# Altium schematic sheet Схема GSM Velvet Controller.SchDoc
size A3; SheetNumber: 5; SheetTotal: 6
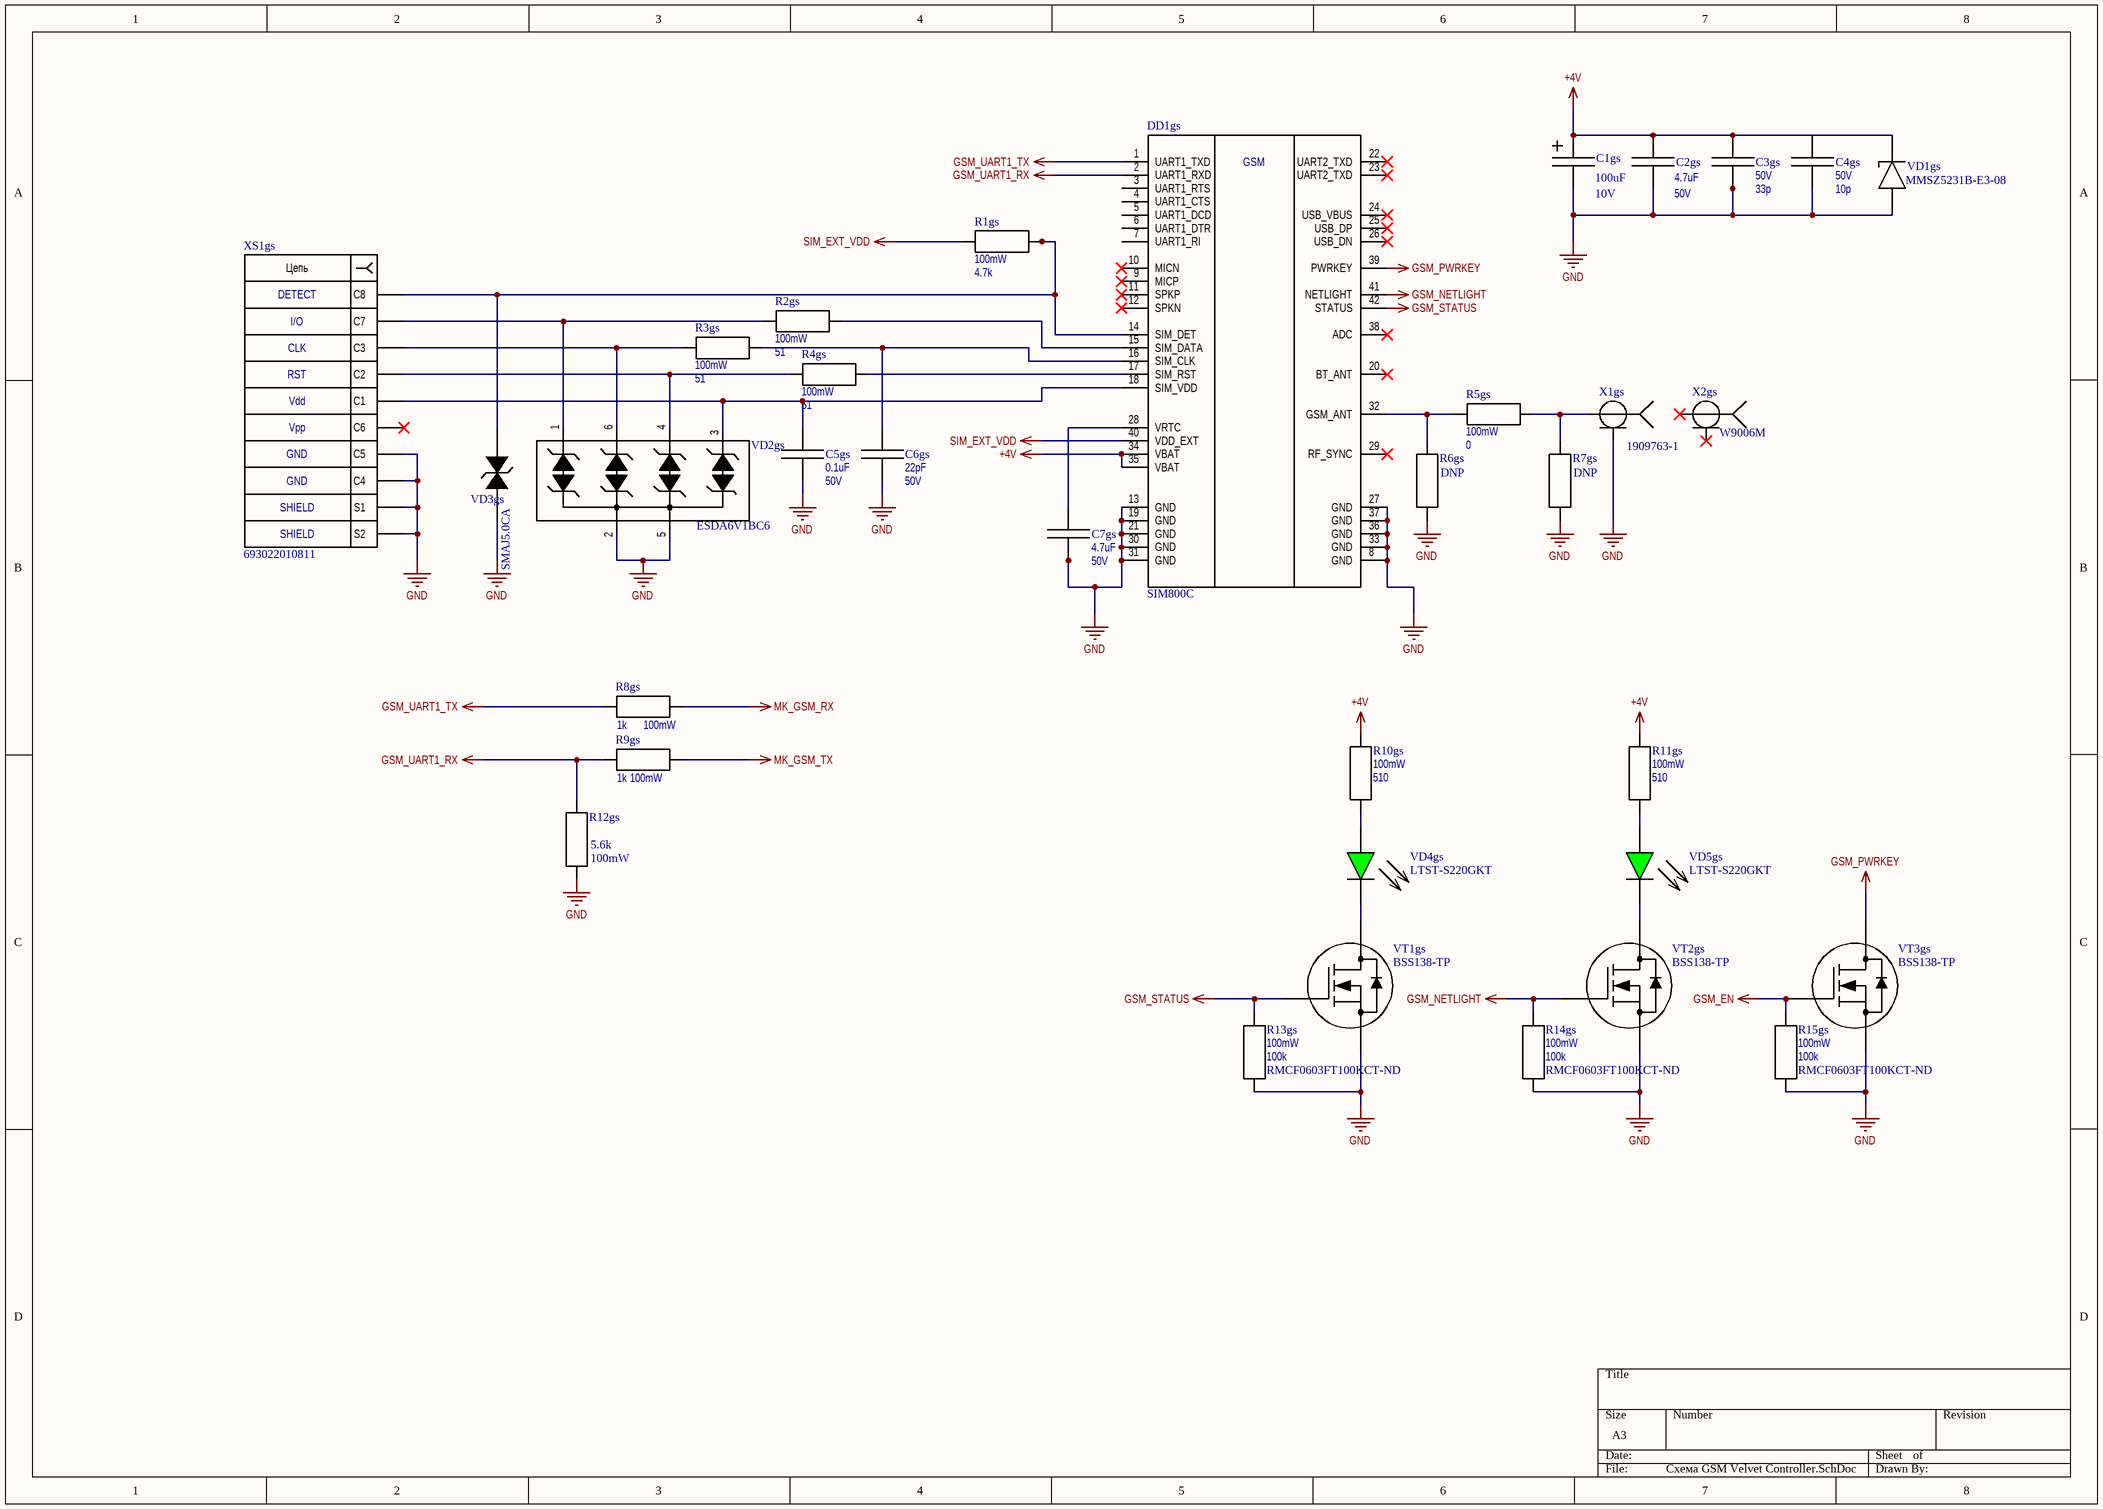
[diagram p0: Схема GSM Velvet Controller.SchDoc]

## Parts
C1gs  Capacitance: 100uF  Rated Voltage: 10V  [CAP 2917 (D)]  (hidden comment: TPSD107M010R0050)
C2gs  Capacitance: 4.7uF  Rated Voltage: 50V  [CAP 0805 IPC MAX]  (hidden comment: CL21A475KBQNNNE)
C3gs  Rated Voltage: 50V  Capacitance: 33p  [CAP 0603 IPC MAX]  (hidden comment: C0603C330J5GAC7867)
C4gs  Rated Voltage: 50V  Capacitance: 10p  [CAP 0603 IPC MAX]  (hidden comment: CC0603JRNPO9BN100)
C5gs  Capacitance: 0.1uF  Rated Voltage: 50V  [CAP 0603 IPC MAX]  (hidden comment: GCM188R71H104KA57D)
C6gs  Capacitance: 22pF  Rated Voltage: 50V  [CAP 0603 IPC MAX]  (hidden comment: CC0603JRNPO9BN220)
C7gs  Capacitance: 4.7uF  Rated Voltage: 50V  [CAP 0805 IPC MAX]  (hidden comment: CL21A475KBQNNNE)
DD1gs  SIM800C  [SIM-800C]
R1gs  Rated Power: 100mW  Resistance: 4.7k  [RES 0603 IPC MAX]  (hidden comment: RMCF0603FT4K70)
R2gs  Rated Power: 100mW  Resistance: 51  [RES 0603 IPC MAX]  (hidden comment: RMCF0603FT51R0)
R3gs  Rated Power: 100mW  Resistance: 51  [RES 0603 IPC MAX]  (hidden comment: RMCF0603FT51R0)
R4gs  Rated Power: 100mW  Resistance: 51  [RES 0603 IPC MAX]  (hidden comment: RMCF0603FT51R0)
R5gs  Rated Power: 100mW  Resistance: 0  [RES 0603 IPC MAX]  (hidden comment: RMCF0603ZT0R00)
R6gs  DNP  [RES 0603 IPC MAX]
R7gs  DNP  [RES 0603 IPC MAX]
R8gs  Resistance: 1k  Rated Power: 100mW  [RES 0603 IPC MAX]  (hidden comment: RMCF0603FT1K00)
R9gs  Resistance: 1k  Rated Power: 100mW  [RES 0603 IPC MAX]  (hidden comment: RMCF0603FT1K00)
R10gs  Power Rated: 100mW  Resistance: 510  [RES 0603 IPC MAX]  (hidden comment: RMCF0603JT510R)
R11gs  Power Rated: 100mW  Resistance: 510  [RES 0603 IPC MAX]  (hidden comment: RMCF0603JT510R)
R12gs  Resistance: 5.6k  Rated Power: 100mW  [RES 0603 IPC MAX]  (hidden comment: RMCF0603FT5K60)
R13gs  Power Rated: 100mW  Resistance: 100k  Supplier Part Number 1: RMCF0603FT100KCT-ND  [RES 0603 IPC MAX]  (hidden comment: RMCF0603FT100K)
R14gs  Power Rated: 100mW  Resistance: 100k  Supplier Part Number 1: RMCF0603FT100KCT-ND  [RES 0603 IPC MAX]  (hidden comment: RMCF0603FT100K)
R15gs  Power Rated: 100mW  Resistance: 100k  Supplier Part Number 1: RMCF0603FT100KCT-ND  [RES 0603 IPC MAX]  (hidden comment: RMCF0603FT100K)
VD1gs  MMSZ5231B-E3-08  [SOD-123 (Marked)]
VD2gs  ESDA6V1BC6  [SOT-23-6]
VD3gs  SMAJ5.0CA  [DO-214AC Bidirectional]
VD4gs  LTST-S220GKT  [0805 DIODE]
VD5gs  LTST-S220GKT  [0805 DIODE]
VT1gs  BSS138-TP  [SOT-23-3]
VT2gs  BSS138-TP  [SOT-23-3]
VT3gs  BSS138-TP  [SOT-23-3]
X1gs  1909763-1  [1909763-1]
X2gs  W9006M  (mechanical)
XS1gs  693022010811  [693022010811]

## Nets
+4V: C1gs.1 C2gs.1 C3gs.1 C4gs.1 DD1gs.34(VBAT) DD1gs.35(VBAT) R10gs.2 R11gs.2 VD1gs.1
GND: C1gs.2 C2gs.2 C3gs.2 C4gs.2 C5gs.2 C6gs.2 C7gs.2 DD1gs.8(GND) DD1gs.13(GND) DD1gs.19(GND) DD1gs.21(GND) DD1gs.27(GND) DD1gs.30(GND) DD1gs.31(GND) DD1gs.33(GND) DD1gs.36(GND) DD1gs.37(GND) R6gs.1 R7gs.1 R12gs.1 R13gs.1 R14gs.1 R15gs.1 VD1gs.2 VD2gs.2 VD2gs.5 VD3gs.1 VT1gs.2(S) VT2gs.2(S) VT3gs.2(S) X1gs.2 XS1gs.C4 XS1gs.C5 XS1gs.S1 XS1gs.S2
GSM_EN: R15gs.2 VT3gs.1(G)
GSM_NETLIGHT: DD1gs.41(NETLIGHT) R14gs.2 VT2gs.1(G)
GSM_PWRKEY: DD1gs.39(PWRKEY) VT3gs.3(D)
GSM_STATUS: DD1gs.42(STATUS) R13gs.2 VT1gs.1(G)
GSM_UART1_RX: DD1gs.2(UART1_RXD) R9gs.1 R12gs.2
GSM_UART1_TX: DD1gs.1(UART1_TXD) R8gs.1
MK_GSM_RX: R8gs.2
MK_GSM_TX: R9gs.2
SIM_EXT_VDD: DD1gs.40(VDD_EXT) R1gs.1
NetC5gs_1: C5gs.1 DD1gs.18(SIM_VDD) VD2gs.3 XS1gs.C1
NetC6gs_1: C6gs.1 DD1gs.16(SIM_CLK) R3gs.2
NetC7gs_1: C7gs.1 DD1gs.28(VRTC)
NetDD1gs_14: DD1gs.14(SIM_DET) R1gs.2 VD3gs.2 XS1gs.C8
NetDD1gs_15: DD1gs.15(SIM_DATA) R2gs.2
NetDD1gs_17: DD1gs.17(SIM_RST) R4gs.2
NetDD1gs_32: DD1gs.32(GSM_ANT) R5gs.1 R6gs.2
NetR2gs_1: R2gs.1 VD2gs.1 XS1gs.C7
NetR3gs_1: R3gs.1 VD2gs.6 XS1gs.C3
NetR4gs_1: R4gs.1 VD2gs.4 XS1gs.C2
NetR5gs_2: R5gs.2 R7gs.2 X1gs.1
NetR10gs_1: R10gs.1 VD4gs.1
NetR11gs_1: R11gs.1 VD5gs.1
NetVD4gs_2: VD4gs.2 VT1gs.3(D)
NetVD5gs_2: VD5gs.2 VT2gs.3(D)

Not connected (* = marked no-connect by the designer): DD1gs 3(UART1_RTS) 4(UART1_CTS) 5(UART1_DCD) 6(UART1_DTR) 7(UART1_RI) 9(MICP)* 10(MICN)* 11(SPKP)* 12(SPKN)* 20(BT_ANT)* 22(UART2_TXD)* 23(UART2_TXD)* 24(USB_VBUS)* 25(USB_DP)* 26(USB_DN)* 29(RF_SYNC)* 38(ADC)*; X2gs 1* 2*; XS1gs C6*

## Notes on the sheet
- (in symbol 693022010811) Цепь; DETECT; I/O; CLK; RST; Vdd; Vpp; GND; SHIELD
- (in symbol SIM800C) GSM

## Library data of the parts
C1gs = TPSD107M010R0050: CAP SMD TANT 100UF 20% 10V 2917; Manufacturer 1: KYOCERA AVX; Type: Molded; ESR: 50mOhm; Manufacturer Part Number 1: TPSD107M010R0050; Min Operating Temperature: -55°C; Max Operating Temperature: 125°C; Tolerance: 20%; Size Code: 2917; Mounting: SM; Package: D
C2gs C7gs = CL21A475KBQNNNE: CAP SMD CER 4.7UF 50V X5R 0805; Manufacturer 1: Samsung Electro-Mechanics; Tolerance: 10%; Type: Multilayer Ceramic; Manufacturer Part Number 1: CL21A475KBQNNNE; Min Operating Temperature: -55°C; Max Operating Temperature: 85°C; Mounting: SM; Package: 0805; Supplier 1: Digi-Key; Supplier Part Number 1: 1276-1248-1-ND
C3gs = C0603C330J5GAC7867: CAP SMD CER 33PF 50V C0G/NP0 0603; Manufacturer 1: KEMET; Tolerance: 5%; Type: Multilayer Ceramic; Manufacturer Part Number 1: C0603C330J5GAC7867; Min Operating Temperature: -55°C; Max Operating Temperature: 125°C; Mounting: SM; Package: 0603; Supplier 1: Digi-Key
C4gs = CC0603JRNPO9BN100: CAP SMD CER 10PF 50V C0G/NP0 0603; Manufacturer 1: YAGEO; Tolerance: 5%; Type: Multilayer Ceramic; Manufacturer Part Number 1: CC0603JRNPO9BN100; Min Operating Temperature: -55°C; Max Operating Temperature: 125°C; Mounting: SM; Package: 0603; Supplier 1: Digi-Key; Supplier Part Number 1: 311-1058-1-ND
C5gs = GCM188R71H104KA57D: CAP SMD CER 0.1UF 50V X7R 0603; Manufacturer 1: Murata Electronics; Tolerance: 10%; Type: Multilayer Ceramic; Manufacturer Part Number 1: GCM188R71H104KA57D; Min Operating Temperature: -55°C; Max Operating Temperature: 125°C; Mounting: SM; Package: 0603; Supplier 1: Digi-Key; Supplier Part Number 1: 490-4779-1-ND
C6gs = CC0603JRNPO9BN220: CAP SMD CER 22PF 50V NP0  0603; Manufacturer 1: YAGEO; Tolerance: 5%; Type: Multilayer Ceramic; Manufacturer Part Number 1: CC0603JRNPO9BN220; Min Operating Temperature: -55°C; Max Operating Temperature: 125°C; Mounting: SM; Package: 0603; Supplier 1: Digi-Key; Supplier Part Number 1: 311-1062-1-ND
DD1gs = SIM800C: GSM/GPRS Module; Manufacturer 1: SIMCom; Supply Voltage: 4V; Manufacturer Part Number 1: SIM800C; Max Operating Temperature: +85 °C; Min Operating Temperature: -40 °C; Parameter 6: *; Parameter 7: *; Parameter 8: *; Parameter 9: *; Parameter 10: *; Parameter 11: *; Parameter 12: *; Parameter 13: *; Parameter 14: *; Parameter 15: *
R1gs = RMCF0603FT4K70: RES SMD 4.7k OHM 1% 1/10W 0603; Manufacturer 1: Stackpole Electronics Inc; Rated Voltage: 75V; Qualification: AEC-Q200; Manufacturer Part Number 1: RMCF0603FT4K70; Tolerance: 1%; Package: 0603; Min Operating Temperature: -55°C; Max Operating Temperature: 155°C
R2gs R3gs R4gs = RMCF0603FT51R0: RES SMD 51 OHM 1% 1/10W 0603; Manufacturer 1: Stackpole Electronics Inc; Rated Voltage: 75V; Qualification: AEC-Q200; Manufacturer Part Number 1: RMCF0603FT51R0; Tolerance: 1%; Package: 0603; Min Operating Temperature: -55°C; Max Operating Temperature: 155°C
R5gs = RMCF0603ZT0R00: RES SMD 0 OHM 1% 1/10W 0603; Manufacturer 1: Stackpole Electronics Inc; Rated Voltage: 75V; Qualification: AEC-Q200; Manufacturer Part Number 1: RMCF0603ZT0R00; Tolerance: 1%; Package: 0603; Min Operating Temperature: -55°C; Max Operating Temperature: 155°C
R6gs R7gs = RES GOST: RES SMD/TH ?R (&K) OHM ?% ?W (PACKAGE)
R8gs R9gs = RMCF0603FT1K00: RES SMD 1K OHM 1% 1/10W 0603; Manufacturer 1: Stackpole Electronics Inc; Rated Voltage: 75V; Qualification: AEC-Q200; Manufacturer Part Number 1: RMCF0603FT1K00; Tolerance: 1%; Package: 0603; Min Operating Temperature: -55°C; Max Operating Temperature: 155°C
R10gs R11gs = RMCF0603JT510R: RES SMD 510 OHM 5% 1/10W 0603; Manufacturer 1: Stackpole Electronics Inc; Voltage Rated: 75V; Manufacturer Part Number 1: RMCF0603JT510R; Min Operating Temperature: -55°C; Max Operating Temperature: 155°C; Tolerance: 5%; Package: 0603; Ratings: AEC-Q200; Supplier 1: Digi-Key; Supplier Part Number 1: RMCF0603JT510RCT-ND
R12gs = RMCF0603FT5K60: RES SMD 5.6K OHM 1% 1/10W 0603; Manufacturer Part Number 1: RMCF0603FT1K00; Manufacturer 1: Stackpole Electronics Inc; Rated Voltage: 75V; Qualification: AEC-Q200; Tolerance: 1%; Package: 0603; Min Operating Temperature: -55°C; Max Operating Temperature: 155°C
R13gs R14gs R15gs = RMCF0603FT100K: RES SMD 100K OHM 5% 1/10W 0603; Manufacturer 1: Stackpole Electronics Inc; Voltage Rated: 75V; Manufacturer Part Number 1: RMCF0603FT100K; Min Operating Temperature: -55°C; Max Operating Temperature: 155°C; Tolerance: 5%; Package: 0603; Ratings: AEC-Q200; Supplier 1: Digi-Key
VD1gs = MMSZ5231B-E3-08: DIODE ZENER 5.1V 500MW SOD123; Manufacturer 1: Vishay General Semiconductor - Diodes Division; Tolerance: 5%; Max Impedance: 17 Ohm; Reverse Current: 5uA; Manufacturer Part Number 1: MMSZ5231B-E3-08; Min Operating Temperature: -55°C; Max Operating Temperature: 150°C; Zener Voltage: 5.1V; Max Power: 500mW; Package: SOD-123; Mounting: SM
VD2gs = ESDA6V1BC6: TVS DIODE 5VWM SOT23-6; Manufacturer 1: STMicroelectronics; Voltage - Reverse Standoff (Typ): 5V; Voltage - Breakdown (Min): 6.1V; Type: Biderectional; Number Of Chanels: 4; Max Pulse Power: 80W; Manufacturer Part Number 1: ESDA6V1BC6; Mounting: SM; Max Operating Temperature: 125°C; Min Operating Temperature: -40°C; Package: SOT-23-6
VD3gs = SMAJ5.0CA: TVS DIODE 5VWM 9.2VC DO214AC; Manufacturer 1: Littelfuse Inc.; Voltage - Reverse Standoff (Typ): 5V; Voltage - Breakdown (Min): 6.4V; Voltage - Clamping (Max) @ Ipp: 9.2V; Current - Peak Pulse (10/1000µs): 28A (8/20µs); Type: Biderectional; Number Of Chanels: 6; Max Pulse Power: 350W; Manufacturer Part Number 1: SMAJ5.0CA; Mounting: 43.5A; Max Operating Temperature: 150°C; Min Operating Temperature: -65°C; Package: SMA
VD4gs VD5gs = LTST-S220GKT: LED GREEN CLEAR SMD R/A; Manufacturer 1: Lite-On Inc.; Max Continious Current: 30mA; Max Pulse Current: 120mA; Reverse Voltage: 5V; Power Dissipation: 100mW; Forward Voltage: 2.2V; Manufacturer Part Number 1: LTST-S220GKT; Max Operating Temperature: +85°C; Package: 0805
VT1gs VT2gs VT3gs = BSS138-TP: MOSFET N-CH 50V 220MA SOT23; Manufacturer 1: Micro Commercial Co; Type: P-Chanel; Rds On (Max): 3.5Ohm; Vth: 1.5V; Gate Charge: 1.65nC; Vgs Max: 20V; Input Capacitance: 60pF; Max Power Dissipation: 350mW; Vds Max: 50V; Max Drain Current: 220mA; Min Operating Temperature: -55°C; Max Operating Temperature: 150°C; Mounting Type: SM; Package: SOT-23; Manufacturer Part Number 1: BSS138-TP; Supplier 1: Digi-Key; Supplier Part Number 1: BSS138-TPMSCT-ND
X1gs = 1909763-1: CONN UMCC JACK STR 50OHM SMD; pin to pad: 2>2+3
X2gs = W9006M: CABLE ASSY 6" SMA FM TO I-PEX
XS1gs = 693022010811: CONN SMART CARD; Manufacturer 1: Würth Elektronik eiSos GmbH; ComponentLink1 Description: Manufacturer; ComponentLink2 Description: Datasheet; Shielding: Shielded; Connector Type: Connector and Ejector; ComponentLink1URL: http://www.we-online.de; ComponentLink2URL: http://katalog.we-online.de/em/datasheet/693022010811.pdf; Manufacturer Part Number 1: 693022010811; Pins: 8